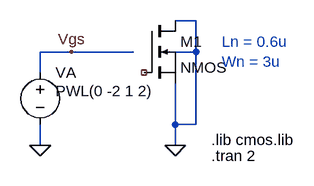
[diagram p0: schematic gatecap.asc]
gatecap.asc, the LTspice schematic file:
Version 4
SHEET 1 1292 680
WIRE -576 0 -608 0
WIRE -768 48 -816 48
WIRE -672 48 -768 48
WIRE -576 48 -576 0
WIRE -576 48 -608 48
WIRE -816 80 -816 48
WIRE -608 160 -608 96
WIRE -576 160 -576 48
WIRE -576 160 -608 160
WIRE -816 192 -816 160
WIRE -608 192 -608 160
FLAG -608 192 0
FLAG -816 192 0
FLAG -768 48 Vgs
SYMBOL voltage -816 64 R0
WINDOW 123 0 0 Left 2
WINDOW 39 0 0 Left 2
WINDOW 3 24 44 Left 2
SYMATTR InstName VA
SYMATTR Value PWL(0 -2 1 2)
SYMBOL nmos -656 0 R0
SYMATTR InstName M1
SYMATTR Value2 l=0.6u w=3u
SYMATTR SpiceModel ""
SYMATTR Value NMOS
TEXT -552 184 Left 2 !.lib cmos.lib
TEXT -536 32 Left 2 ;Ln = 0.6u\nWn = 3u
TEXT -552 208 Left 2 !.tran 2

The netlist it stands for:
* gatecap.asc
VA Vgs 0 PWL(0 -2 1 2)
* M1: NMOS l=0.6u w=3u (symbol nmos not certain, pin order unknown); nets seen at it: 0
.lib cmos.lib
* Ln = 0.6u
* Wn = 3u
.tran 2
.backanno
.end